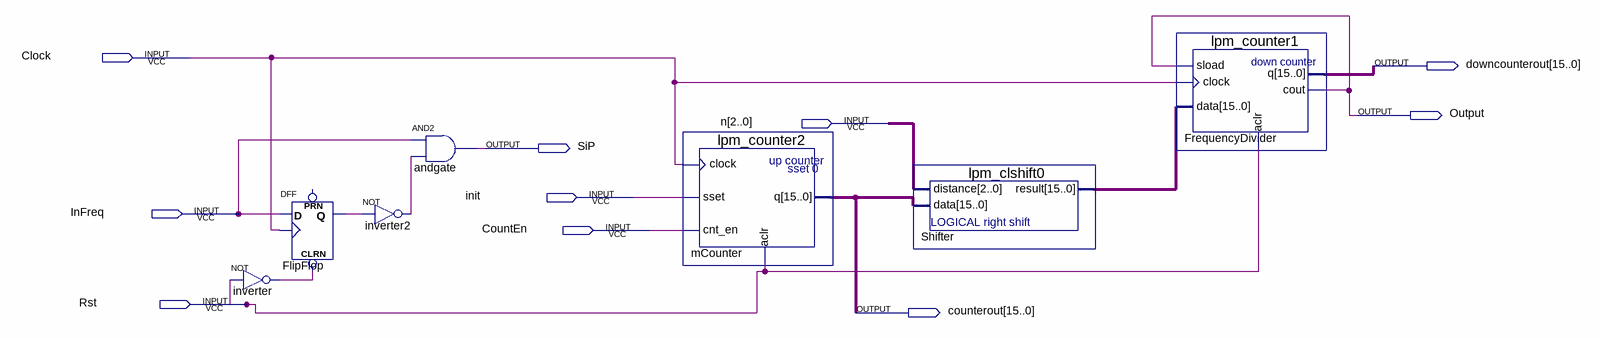
[diagram p0: schematic sheet]
// Quartus schematic ca5.bdf as structural Verilog: 7 symbols, 10 pins
module ca5 (
  input  Clock,
  input  [2:0] n,
  input  init,
  input  InFreq,
  input  CountEn,
  input  Rst,
  output [15:0] downcounterout,
  output Output,
  output SiP,
  output [15:0] counterout
);

  wire FlipFlop_q, inverter2_out, inverter_out;
  wire [15:0] Shifter_result;

  not inverter (inverter_out, Rst);
  DFF FlipFlop (.CLRN(inverter_out), .CLK(Clock), .D(InFreq), .Q(FlipFlop_q));  // open: PRN
  not inverter2 (inverter2_out, FlipFlop_q);
  and andgate (SiP, InFreq, inverter2_out);
  lpm_counter2 mCounter (.sset(init), .clock(Clock), .cnt_en(CountEn), .aclr(Rst), .q(counterout));
  lpm_clshift0 Shifter (.data(counterout), .distance(n), .result(Shifter_result));
  lpm_counter1 FrequencyDivider (
    .sload(Output), .data(Shifter_result), .clock(Clock), .aclr(Rst), .cout(Output), .q(downcounterout));
endmodule
